# Altium schematic sheet WAN.SchDoc
size A4
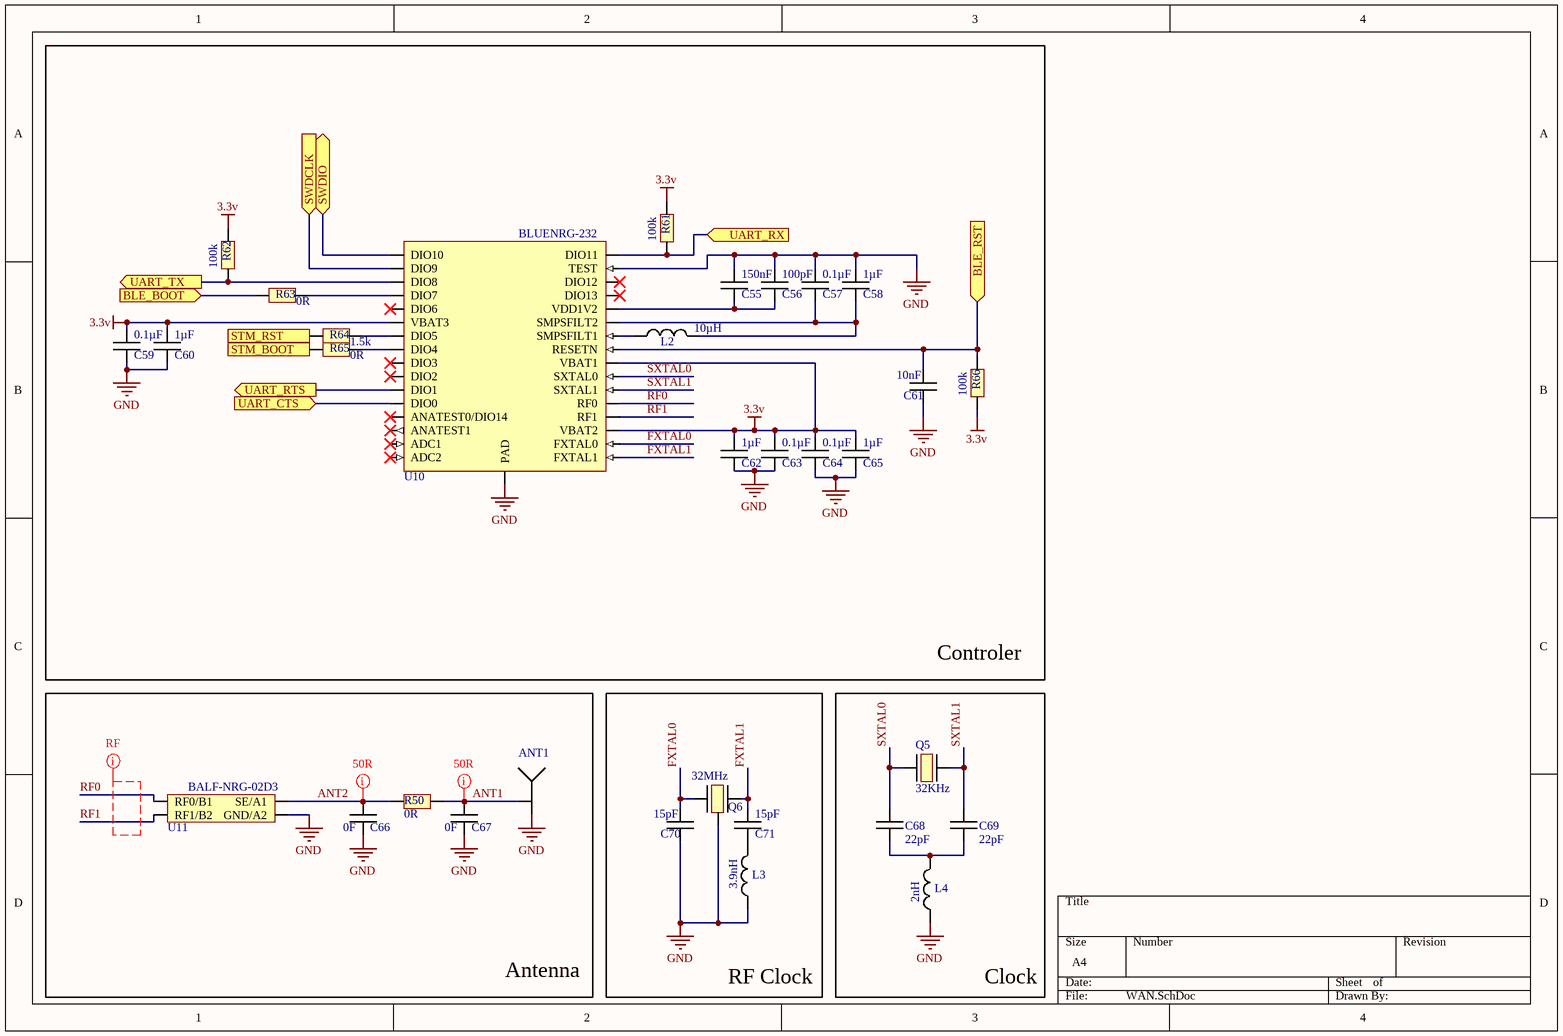
[diagram p0: WAN.SchDoc]

## Parts
ANT1  UFL  [UFL]  (value not drawn)
C55  150nF  [0603]
C56  100pF  [0603]
C57  0.1µF  [0603]
C58  1µF  [0603]
C59  0.1µF  [0603]
C60  1µF  [0603]
C61  10nF  [0603]
C62  1µF  [0603]
C63  0.1µF  [0603]
C64  0.1µF  [0603]
C65  1µF  [0603]
C66  0F  [0603]
C67  0F  [0603]
C68  22pF  [0603]
C69  22pF  [0603]
C70  15pF  [0603]
C71  15pF  [0603]
L2  10µH  [0603]
L3  3.9nH  [0402]
L4  2nH  [0603]
Q5  32KHz  [BLE_Quartz_Sxtal]
Q6  32MHz  [BLE_Quartz_Fxtal]
R50  0R  [0603]
R61  100k  [0603]
R62  100k  [0603]
R63  0R  [0603]
R64  1.5k  [0603]
R65  0R  [0603]
R66  100k  [0603]
U10  BLUENRG-232  [QFN50P500X500X100_HS-33M]
U11  BALF-NRG-02D3  [4-UFBGA]

## Blocks framed on the sheet
Controler: C55-C65 L2 R61-R66 U10
Antenna: ANT1 C66 C67 R50 U11
RF Clock: C70 C71 L3 Q6
Clock: C68 C69 L4 Q5

## Ports
BLE_BOOT (in), BLE_RST (in), STM_BOOT (out), STM_RST (out), SWDCLK (in), SWDIO (bidir), UART_CTS (in), UART_RTS (out), UART_RX (in), UART_TX (out)

## Nets
3.3v: C59.2 C60.2 C62.2 C63.2 C64.2 C65.2 R61.2 R62.2 R66.1 U10.6(VBAT3) U10.19(VBAT2) U10.24(VBAT1)
GND: ANT1.2(GND) C55.2 C56.2 C57.2 C58.2 C59.1 C60.1 C61.1 C62.1 C63.1 C64.1 C65.1 C66.1 C67.1 C70.1 L3.1 L4.1 Q6.3 U10.31(TEST) U10.33(PAD) U11.2(GND/A2)
ANT1: ANT1.1(GND) C67.2 R50.2
ANT2: C66.2 R50.1 U11.1(SE/A1)
BLE_BOOT: R63.2 ; port BLE_BOOT
BLE_RST: C61.2 R66.2 U10.25(RESETN) ; port BLE_RST
FXTAL0: C70.2 Q6.1 U10.18(FXTAL0)
FXTAL1: C71.2 Q6.2 U10.17(FXTAL1)
RF0: U10.21(RF0) U11.3(RF0/B1)
RF1: U10.20(RF1) U11.4(RF1/B2)
STM_BOOT: R65.2 ; port STM_BOOT
STM_RST: R64.2 ; port STM_RST
SWDCLK: U10.2(DIO9) ; port SWDCLK
SWDIO: U10.1(DIO10) ; port SWDIO
SXTAL0: C68.2 Q5.2 U10.23(SXTAL0)
SXTAL1: C69.2 Q5.1 U10.22(SXTAL1)
UART_CTS: U10.12(DIO0) ; port UART_CTS
UART_RTS: U10.11(DIO1) ; port UART_RTS
UART_RX: R61.1 U10.32(DIO11) ; port UART_RX
UART_TX: R62.1 U10.3(DIO8) ; port UART_TX
NetC55_1: C55.1 C56.1 U10.28(VDD1V2)
NetC57_1: C57.1 C58.1 L2.2 U10.27(SMPSFILT2)
NetC68_1: C68.1 C69.1 L4.2
NetC71_1: C71.1 L3.2
NetL2_1: L2.1 U10.26(SMPSFILT1)
NetR63_1: R63.1 U10.4(DIO7)
NetR64_1: R64.1 U10.7(DIO5)
NetR65_1: R65.1 U10.8(DIO4)

Not connected (* = marked no-connect by the designer): U10 5(DIO6)* 9(DIO3)* 10(DIO2)* 13(ANATEST0/DIO14)* 14(ANATEST1)* 15(ADC1)* 16(ADC2)* 29(DIO13)* 30(DIO12)*

## Layout directives
rule Length Constraint [Min Length = 0.7mm    Max Length = 0.9mm]: (no net found under the mark)
rule Width Constraint [Pref Width = 0.25mm    Min Width = 0.25mm    Max Width = 0.25mm]; rule Clearance Constraint [Clearance = 0.2mm]; net class 50R: ANT1, ANT2

## Library data of the parts
ANT1 = UFL: Manufacturer 1: Hirose; Manufacturer Part Number 1: U.FL-R-SMT-1(40); Body Material: Bronze; Body Plating: Silver; Dielectric Material: Polymer; Impedance: 50R; Connector Type: Coaxial,Receptacle,Male Pin; Max Frequency: 6GHz; Polarity: Standard; Insulation Resistance: 500MR; Gender: Female; Supplier 1: Mouser; Stock 1: 562; Pricing 1: 1=1,14000, 10=0,93600, 100=0,85900, 250=0,78000, 500=0,71600, 1000=0,62400, 4000=0,54600, 8000=0,50800 (USD); RoHS: Yes; Mount: Surface Mount; Contact Material: Brass,Bronze; Contact Plating: Gold; Housing Color: Beige; Min Operating Temperature: -40°C; Max Operating Temperature: 90°C; Package Quantity: 4000; Packaging: Tape and Reel; Fastening Type: Snap; Termination: Solder; Frequency: 6GHz; Orientation: Vertical; Lead Free: Lead Free; ComponentLink1URL: https://datasheet.ciiva.com/18563/uflseries-18563675.pdf?src-supplier=Digi-Key; ComponentLink1Description: https://datasheet.ciiva.com/18563/uflseries-18563675.pdf?src-supplier=Digi-Key; Supplier Part Number 1: 798-UFLRSMT140
C55-C71 = Capa
L2 = Self: Manufacturer 1: TDK; Manufacturer Part Number 1: MLZ1608M100WT; Core Material: Ferrite; Tolerance: 20%; Self Resonant Frequency: 17MHz; Shielding: Shielded; Inductance: 10uH; Max DC Current: 250mA; DC Resistance (DCR): 1.05R; Test Frequency: 2MHz; DC Current: 90mA; Supplier 1: Farnell; Supplier Part Number 1: 2215635; Stock 1: 796; Pricing 1: 10=0,13600, 100=0,09360, 500=0,07170, 1000=0,05980, 2000=0,05180, 4000=0,04090, 20000=0,03940 (EUR); RoHS: Yes; Mount: Surface Mount; Case/Package: 603; Case Code (Metric): 1608; Case Code (Imperial): 0603; Min Operating Temperature: -55°C; Max Operating Temperature: 125°C; Packaging: Cut Tape; Inductance Tolerance: 20%; Military Standard: Not; Length: 1.75mm; Depth: 0.95mm; REACH SVHC: No SVHC; ComponentLink1URL: https://datasheet.ciiva.com/8045/1649095-8045526.pdf?src-supplier=Element14; ComponentLink1Description: https://datasheet.ciiva.com/8045/1649095-8045526.pdf?src-supplier=Element14
L3 = self2: Manufacturer 1: Murata; Manufacturer Part Number 1: LQG15WZ3N9S02D; Core Material: Air; Current Rating: 900mA; Shielding: Unshielded; DC Resistance (DCR): 90mR; Self Resonant Frequency: 5GHz; Test Frequency: 100MHz; Supplier 1: Digi-Key; Supplier Part Number 1: 490-15282-1-ND; Stock 1: 7036; Pricing 1: 1=0,15000, 10=0,13500, 100=0,08970, 500=0,07476, 1000=0,06279, 2500=0,05382 (USD); RoHS: No; Mount: Surface Mount; Case/Package: 0402; Case Code (Imperial): 0402; Case Code (Metric): 1005; Min Operating Temperature: -55°C; Max Operating Temperature: 125°C; Packaging: Cut Tape; Inductance: 3.9nH; Ratings: AEC-Q200; ComponentLink1URL: http://search.murata.co.jp/Ceramy/image/img/P02/JELF243B-9117.pdf?src-supplier=Digi-Key; ComponentLink1Description: http://search.murata.co.jp/Ceramy/image/img/P02/JELF243B-9117.pdf?src-supplier=Digi-Key
L4 = Self: Manufacturer 1: Murata; Manufacturer Part Number 1: BLM18GG471SN1D; Core Material: Ferrite; Material: Steel,Ferrite; Max Current Rating: 200mA; Impedance: 470R; Tolerance: 25%; Number of Lines: 1; Resistance: 1.3R; DC Resistance (DCR): 300mR; Test Frequency: 100MHz; Supplier 1: Digi-Key; Supplier Part Number 1: 490-5981-1-ND; Stock 1: 23621; Pricing 1: 1=0,27000, 10=0,20600, 25=0,17080, 50=0,14740, 100=0,13270, 250=0,11204, 500=0,10024, 1000=0,08549 (USD); RoHS: Yes; Case/Package: 0603; Number of Pins: 2; Case Code (Metric): 1608; Case Code (Imperial): 0603; Contact Plating: Tin,Matte; Min Operating Temperature: -55°C; Max Operating Temperature: 125°C; Package Quantity: 1; Packaging: Tape and Reel; Current Rating: 200mA; Max DC Current: 200mA; Termination: Flat; Number of Circuits: 1; Length: 1.6mm; Height: 0.8mm; Width: 0.8mm; Depth: 0.8mm; REACH SVHC: No SVHC; Lead Free: Lead Free; ComponentLink1URL: https://datasheet.ciiva.com/3067/l0110s0105blm18g-3067184.pdf?src-supplier=Avnet; ComponentLink1Description: https://datasheet.ciiva.com/3067/l0110s0105blm18g-3067184.pdf?src-supplier=Avnet; ComponentLink2URL: https://datasheet.ciiva.com/11800/0900766b811b5866-11800884.pdf?src-supplier=RSComponents; ComponentLink2Description: https://datasheet.ciiva.com/11800/0900766b811b5866-11800884.pdf?src-supplier=RSComponents; ComponentLink3URL: https://datasheet.ciiva.com/1467/5170-1467240.pdf?src-supplier=Element14; ComponentLink3Description: https://datasheet.ciiva.com/1467/5170-1467240.pdf?src-supplier=Element14; ComponentLink4URL: https://datasheet.ciiva.com/27747/1844951-27747823.pdf?src-supplier=Jameco; ComponentLink4Description: https://datasheet.ciiva.com/27747/1844951-27747823.pdf?src-supplier=Jameco; ComponentLink5URL: https://datasheet.ciiva.com/41449/001171701-da-01-en-chip-drossel0603-470r-200ma-1-6x0-8mm-41449377.pdf?src-supplier=Conrad; ComponentLink5Description: https://datasheet.ciiva.com/41449/001171701-da-01-en-chip-drossel0603-470r-200ma-1-6x0-8mm-41449377.pdf?src-supplier=Conrad; ComponentLink6URL: https://datasheet.ciiva.com/41449/001172271-da-01-en-drossel-0603-470r-1-6x0-8mm-4000st-41449611.pdf?src-supplier=Conrad; ComponentLink6Description: https://datasheet.ciiva.com/41449/001172271-da-01-en-drossel-0603-470r-1-6x0-8mm-4000st-41449611.pdf?src-supplier=Conrad; ComponentLink7URL: https://datasheet.ciiva.com/6211/l0110e-6211878.pdf?src-supplier=Digi-Key; ComponentLink7Description: https://datasheet.ciiva.com/6211/l0110e-6211878.pdf?src-supplier=Digi-Key; ComponentLink8URL: https://datasheet.ciiva.com/6211/l0110e-6211879.pdf?src-supplier=Digi-Key; ComponentLink8Description: https://datasheet.ciiva.com/6211/l0110e-6211879.pdf?src-supplier=Digi-Key; ComponentLink9URL: https://datasheet.ciiva.com/14122/blm-series-eng-tds-14122875.pdf?src-supplier=Distrelec; ComponentLink9Description: https://datasheet.ciiva.com/14122/blm-series-eng-tds-14122875.pdf?src-supplier=Distrelec
Q5 = BLE_quartz_Sxtal: Manufacturer 1: NDK; Manufacturer Part Number 1: NX2012SA-32.768K-STD-MUB-1; Frequency: 32.768kHz; Load Capacitance: 12.5pF; ESR (Equivalent Series Resistance): 80kR; Frequency Tolerance: 20ppm; Supplier 1: Digi-Key; Stock 1: 28609; Pricing 1: 1=0,91000, 10=0,80500, 50=0,75200, 100=0,66460, 500=0,62964, 1000=0,52470 (USD); RoHS: Yes; Mount: Surface Mount; Case/Package: SMD/SMT; Min Operating Temperature: -40°C; Max Operating Temperature: 85°C; Packaging: Tape and Reel; Length: 0.081inch; Height: 0.024inch; Width: 0.047inch; ComponentLink1URL: http://www.ndk.com/images/products/catalog/c_NX2012SA-STD-MUB-1_e.pdf?src-supplier=Digi-Key; ComponentLink1Description: http://www.ndk.com/images/products/catalog/c_NX2012SA-STD-MUB-1_e.pdf?src-supplier=Digi-Key; Supplier Part Number 1: 644-1219-1-ND
Q6 = BLE_Quartz_Fxtal: Manufacturer 1: Kyocera AVX; Manufacturer Part Number 1: CX2016DB32000D0FLJCC; Load Capacitance: 8pF; ESR (Equivalent Series Resistance): 80R; Frequency Tolerance: 10ppm; Frequency Stability: 15ppm; Supplier 1: Digi-Key; Stock 1: 89937; Pricing 1: 1=0,94000, 10=0,83500, 50=0,78040, 100=0,68970, 500=0,65340, 1000=0,54450 (USD); RoHS: Yes; Mount: Surface Mount; Case/Package: SMD/SMT; Number of Pins: 4; Min Operating Temperature: -30°C; Max Operating Temperature: 85°C; Frequency: 32MHz; Packaging: Tape and Reel; Package Quantity: 3000; Tolerance: 10ppm; Termination: SMD/SMT; Series Resistance: 80R; Length: 0.079inch; Height: 0.018inch; Width: 1.6mm; Lead Pitch: 1.4mm; REACH SVHC: No SVHC; ComponentLink1URL: https://datasheet.ciiva.com/29631/cx2016db-wl-e-29631269.pdf?src-supplier=Digi-Key; ComponentLink1Description: https://datasheet.ciiva.com/29631/cx2016db-wl-e-29631269.pdf?src-supplier=Digi-Key; ComponentLink2URL: https://datasheet.ciiva.com/29631/cx2016db-wl-e-29631270.pdf?src-supplier=Digi-Key; ComponentLink2Description: https://datasheet.ciiva.com/29631/cx2016db-wl-e-29631270.pdf?src-supplier=Digi-Key; ComponentLink3URL: https://datasheet.ciiva.com/29631/cx2016db-wl-e-29631271.pdf?src-supplier=Digi-Key; ComponentLink3Description: https://datasheet.ciiva.com/29631/cx2016db-wl-e-29631271.pdf?src-supplier=Digi-Key; Supplier Part Number 1: 1253-1118-1-ND
R50 R61-R66 = Resistance
U10 = BLUENRG-232: Manufacturer 1: STMicroelectronics; Supplier 1: Farnell; Manufacturer Part Number 1: BLUENRG-232; Stock 1: 3489; Pricing 1: 1=3,54000, 10=2,68000, 25=2,55000, 50=2,44000, 100=2,32000, 250=2,20000, 500=1,98000, 1000=1,64000 (EUR); RoHS: No; ComponentLink1URL: http://www.farnell.com/datasheets/2327324.pdf?src-supplier=Farnell; ComponentLink1Description: http://www.farnell.com/datasheets/2327324.pdf?src-supplier=Farnell; ComponentLink2URL: https://www.st.com/resource/en/flyer/flbluenrg21017.pdf?src-supplier=Digi-Key; ComponentLink2Description: https://www.st.com/resource/en/flyer/flbluenrg21017.pdf?src-supplier=Digi-Key; ComponentLink3URL: http://www.farnell.com/datasheets/2327324.pdf?src-supplier=Newark; ComponentLink3Description: http://www.farnell.com/datasheets/2327324.pdf?src-supplier=Newark; Supplier Part Number 1: 2771347
U11 = Balf: Manufacturer 1: STMicroelectronics; Supplier 1: Digi-Key; Manufacturer Part Number 1: BALF-NRG-02D3; Stock 1: 10182; Pricing 1: 1=0,40000, 10=0,34700, 100=0,25870, 500=0,20328, 1000=0,15708 (USD); RoHS: No; ComponentLink1URL: http://www.farnell.com/datasheets/2342732.pdf?src-supplier=Farnell; ComponentLink1Description: http://www.farnell.com/datasheets/2342732.pdf?src-supplier=Farnell; ComponentLink2URL: http://www.st.com/content/ccc/resource/technical/document/datasheet/group3/51/4f/c4/19/79/13/4a/ad/DM00408204/files/DM00408204.pdf/jcr:content/translations/en.DM00408204.pdf?src-supplier=Digi-Key; ComponentLink2Description: http://www.st.com/content/ccc/resource/technical/document/datasheet/group3/51/4f/c4/19/79/13/4a/ad/DM00408204/files/DM00408204.pdf/jcr:content/translations/en.DM00408204.pdf?src-supplier=Digi-Key; ComponentLink3URL: http://www.farnell.com/datasheets/2342732.pdf?src-supplier=Newark; ComponentLink3Description: http://www.farnell.com/datasheets/2342732.pdf?src-supplier=Newark; Supplier Part Number 1: 497-17591-1-ND